# Altium schematic sheet AEBS component_Rear.SchDoc
size A4
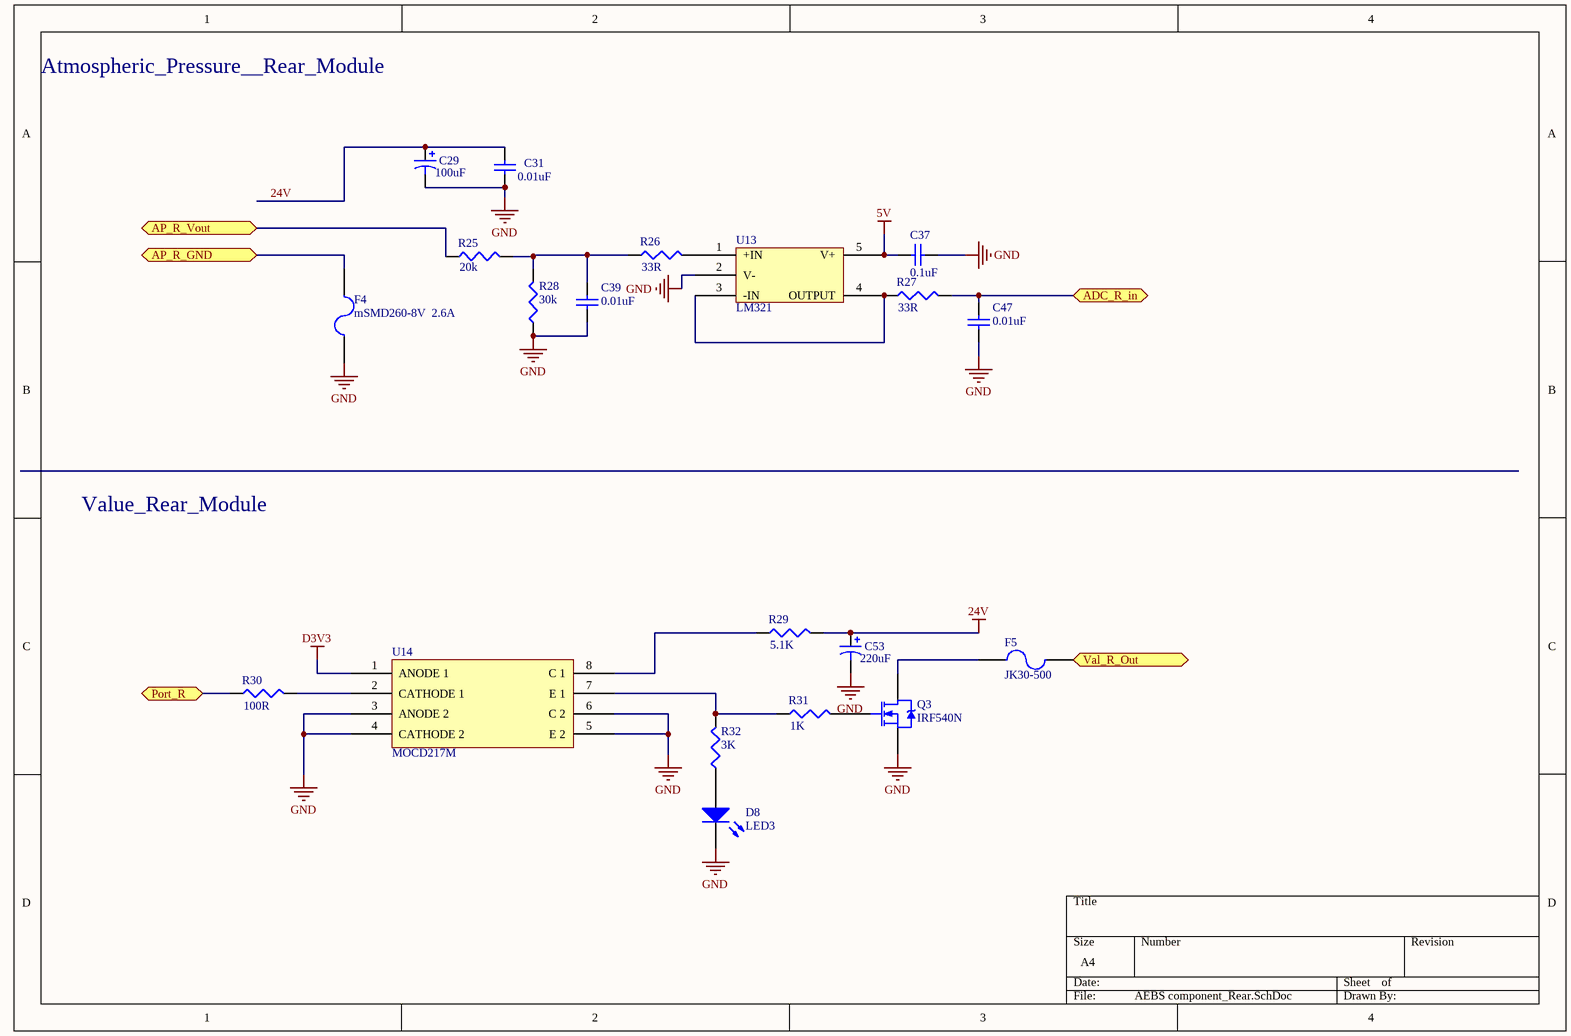
[diagram p0: AEBS component_Rear.SchDoc]

## Parts
C29  value 100uF  [C0805]  (hidden comment: Cap Pol3)
C31  value 0.01uF  [C1206]  (hidden comment: Cap Semi)
C37  value 0.1uF  [1608[0603]]  (hidden comment: Cap Semi)
C39  value 0.01uF  [1608[0603]]  (hidden comment: Cap Semi)
C47  value 0.01uF  [1608[0603]]  (hidden comment: Cap Semi)
C53  value 220uF  [Cap_pol_8*10.2]  (hidden comment: Cap Pol3)
D8  LED3  [1206]
F4  mSMD260-8V  2.6A  [1812]
F5  JK30-500  [JK30-500]
Q3  IRF540N  [TO-220AB]
R25  value 20k  [J1-0603]  (hidden comment: Res3)
R26  value 33R  [J1-0603]  (hidden comment: Res3)
R27  value 33R  [J1-0603]  (hidden comment: Res3)
R28  value 30k  [J1-0603]  (hidden comment: Res3)
R29  value 5.1K  [J1-0603]  (hidden comment: Res3)
R30  value 100R  [J1-0603]  (hidden comment: Res3)
R31  value 1K  [J1-0603]  (hidden comment: Res3)
R32  value 3K  [J1-0603]  (hidden comment: Res3)
U13  LM321  [LM321]
U14  MOCD217M  [MOCD217M]

## Ports
ADC_R_in (bidir), AP_R_GND (bidir), AP_R_Vout (bidir), Port_R (bidir), Val_R_Out (bidir)

## Nets
5V: C37.2 U13.5(V+)
24V: C29.1 C31.1 C53.1 R29.2
D3V3: U14.1(ANODE_1)
GND: C29.2 C31.2 C37.1 C39.1 C47.1 C53.2 D8.2(K) F4.2 Q3.3(S) R28.1 U13.2(V-) U14.3(ANODE_2) U14.4(CATHODE_2) U14.5(E_2) U14.6(C_2)
ADC_R_in: C47.2 R27.2 ; port ADC_R_in
AP_R_GND: F4.1 ; port AP_R_GND
AP_R_Vout: R25.1 ; port AP_R_Vout
Port_R: R30.1 ; port Port_R
Val_R_Out: F5.2 ; port Val_R_Out
NetC39_2: C39.2 R25.2 R26.1 R28.2
NetD8_1: D8.1(A) R32.1
NetF5_1: F5.1 Q3.2(D)
NetQ3_1: Q3.1(G) R31.2
NetR26_2: R26.2 U13.1(+IN)
NetR27_1: R27.1 U13.3(-IN) U13.4(OUTPUT)
NetR29_1: R29.1 U14.8(C_1)
NetR30_2: R30.2 U14.2(CATHODE_1)
NetR31_1: R31.1 R32.2 U14.7(E_1)

## Notes on the sheet
- Atmospheric_Pressure__Rear_Module
- Value_Rear_Module

## Library data of the parts
C29 C53 = Cap Pol3: Polarized Capacitor (Surface Mount); Published: 8-Jun-2000; LatestRevisionDate: 29-May-2009; LatestRevisionNote: IPC-7351 Footprint Added.; PackageReference: C0805; Publisher: Altium Limited; PackageDescription: Chip Capacitor
C31 C37 C39 C47 = Cap Semi: Capacitor (Semiconductor SIM Model); Published: 8-Jun-2000; LatestRevisionDate: 29-May-2009; LatestRevisionNote: IPC-7351 Footprint Added.; PackageReference: C1206; Publisher: Altium Limited; PackageDescription: Chip Capacitor
D8 = LED3: Typical BLUE SiC LED; Published: 8-Jun-2000; LatestRevisionDate: 17-Dec-2003; LatestRevisionNote: PCB Footprint replaced.; DatasheetVersion: 16-Apr-2002; PackageVersion: 16-Apr-2002; PackageReference: 3.5X2.8X1.9; Publisher: Altium Limited; PackageDescription: SM LED; 2 C-Bend Leads; Body 3.5 x 2.8 x 1.9 mm, inc leads (LxWxH typ)
F4 F5 = Fuse 2: Fuse; Published: 8-Jun-2000; LatestRevisionDate: 17-Jul-2002; LatestRevisionNote: Re-released for DXP Platform.; PackageReference: PIN-W2/E2.8; Publisher: Altium Limited; PackageDescription: Thru-Hole; 2 Leads
Q3 = NMOS-2: N-Channel Power MOSFET; Note: Pin 2 is electrically connected to pin 4.; Published: 8-Jun-2000; LatestRevisionDate: 17-Jul-2002; LatestRevisionNote: Re-released for DXP Platform.; DatasheetVersion: PD-9.814; PackageVersion: Feb-1997; PackageReference: TO-220AB; Publisher: Altium Limited; PackageDescription: TO, Thru-Hole, Vertical, Heatsink Mounted; 3 In-Line Leads; Pitch 2.54 mm; ComponentLink1Description: Manufacturer Link; ComponentLink1URL: http://www.irf.com/
R25-R32 = Res3: Resistor; Published: 8-Jun-2000; LatestRevisionDate: 29-May-2009; LatestRevisionNote: IPC-7351 Footprint Added.; PackageReference: J1-0603; Publisher: Altium Limited; PackageDescription: Chip Resistor